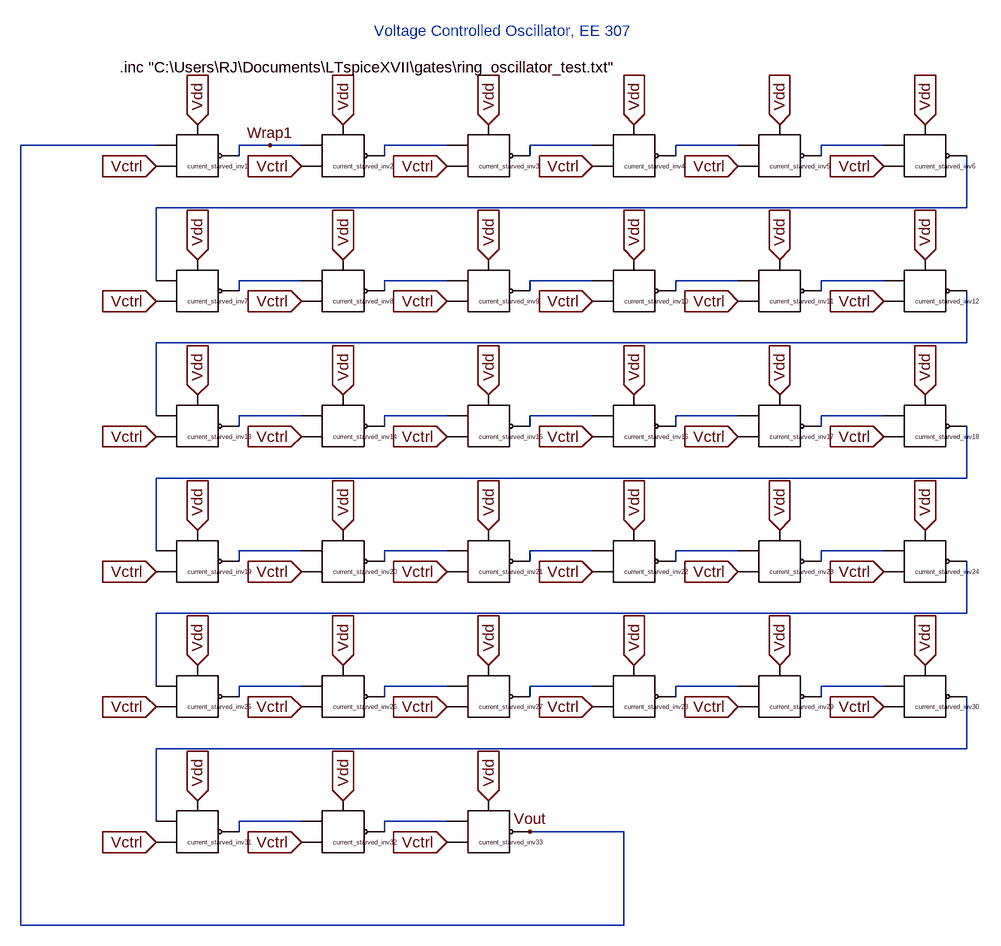
[diagram p0: schematic ring_oscillator.asc]
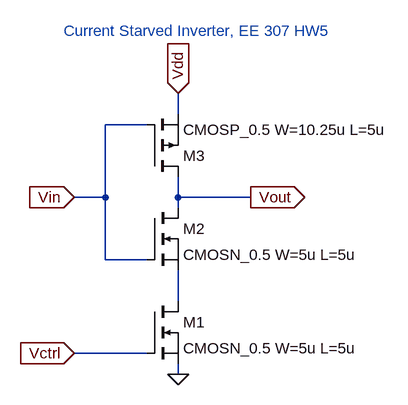
[diagram p1: sub-circuit current_starved_inverter.asc]
ring_oscillator.asc, the LTspice schematic file:
Version 4
SHEET 1 1604 1524
WIRE -256 208 -464 208
WIRE -80 208 -128 208
WIRE -32 208 -80 208
WIRE 192 208 96 208
WIRE 416 208 320 208
WIRE 640 208 544 208
WIRE 864 208 768 208
WIRE -128 224 -128 208
WIRE 96 224 96 208
WIRE 320 224 320 208
WIRE 544 224 544 208
WIRE 768 224 768 208
WIRE 992 304 992 224
WIRE 992 304 -256 304
WIRE -256 416 -256 304
WIRE -32 416 -128 416
WIRE 192 416 96 416
WIRE 416 416 320 416
WIRE 640 416 544 416
WIRE 864 416 768 416
WIRE -128 432 -128 416
WIRE 96 432 96 416
WIRE 320 432 320 416
WIRE 544 432 544 416
WIRE 768 432 768 416
WIRE 992 512 992 432
WIRE 992 512 -256 512
WIRE -256 624 -256 512
WIRE -32 624 -128 624
WIRE 192 624 96 624
WIRE 416 624 320 624
WIRE 640 624 544 624
WIRE 864 624 768 624
WIRE -128 640 -128 624
WIRE 96 640 96 624
WIRE 320 640 320 624
WIRE 544 640 544 624
WIRE 768 640 768 624
WIRE 992 720 992 640
WIRE 992 720 -256 720
WIRE -256 832 -256 720
WIRE -32 832 -128 832
WIRE 192 832 96 832
WIRE 416 832 320 832
WIRE 640 832 544 832
WIRE 864 832 768 832
WIRE -128 848 -128 832
WIRE 96 848 96 832
WIRE 320 848 320 832
WIRE 544 848 544 832
WIRE 768 848 768 832
WIRE 992 928 992 848
WIRE 992 928 -256 928
WIRE -256 1040 -256 928
WIRE -32 1040 -128 1040
WIRE 192 1040 96 1040
WIRE 416 1040 320 1040
WIRE 640 1040 544 1040
WIRE 864 1040 768 1040
WIRE -128 1056 -128 1040
WIRE 96 1056 96 1040
WIRE 320 1056 320 1040
WIRE 544 1056 544 1040
WIRE 768 1056 768 1040
WIRE 992 1136 992 1056
WIRE 992 1136 -256 1136
WIRE -256 1248 -256 1136
WIRE -32 1248 -128 1248
WIRE 192 1248 96 1248
WIRE -128 1264 -128 1248
WIRE 96 1264 96 1248
WIRE 464 1264 320 1264
WIRE -464 1408 -464 208
WIRE 464 1408 464 1264
WIRE 464 1408 -464 1408
FLAG -192 176 Vdd
IOPIN -192 176 In
FLAG 32 176 Vdd
IOPIN 32 176 In
FLAG -256 240 Vctrl
IOPIN -256 240 In
FLAG -32 240 Vctrl
IOPIN -32 240 In
FLAG 256 176 Vdd
IOPIN 256 176 In
FLAG 480 176 Vdd
IOPIN 480 176 In
FLAG 192 240 Vctrl
IOPIN 192 240 In
FLAG 416 240 Vctrl
IOPIN 416 240 In
FLAG 704 176 Vdd
IOPIN 704 176 In
FLAG 928 176 Vdd
IOPIN 928 176 In
FLAG 640 240 Vctrl
IOPIN 640 240 In
FLAG 864 240 Vctrl
IOPIN 864 240 In
FLAG -192 384 Vdd
IOPIN -192 384 In
FLAG 32 384 Vdd
IOPIN 32 384 In
FLAG -256 448 Vctrl
IOPIN -256 448 In
FLAG -32 448 Vctrl
IOPIN -32 448 In
FLAG 256 384 Vdd
IOPIN 256 384 In
FLAG 480 384 Vdd
IOPIN 480 384 In
FLAG 192 448 Vctrl
IOPIN 192 448 In
FLAG 416 448 Vctrl
IOPIN 416 448 In
FLAG 704 384 Vdd
IOPIN 704 384 In
FLAG 928 384 Vdd
IOPIN 928 384 In
FLAG 640 448 Vctrl
IOPIN 640 448 In
FLAG 864 448 Vctrl
IOPIN 864 448 In
FLAG -192 592 Vdd
IOPIN -192 592 In
FLAG 32 592 Vdd
IOPIN 32 592 In
FLAG -256 656 Vctrl
IOPIN -256 656 In
FLAG -32 656 Vctrl
IOPIN -32 656 In
FLAG 256 592 Vdd
IOPIN 256 592 In
FLAG 480 592 Vdd
IOPIN 480 592 In
FLAG 192 656 Vctrl
IOPIN 192 656 In
FLAG 416 656 Vctrl
IOPIN 416 656 In
FLAG 704 592 Vdd
IOPIN 704 592 In
FLAG 928 592 Vdd
IOPIN 928 592 In
FLAG 640 656 Vctrl
IOPIN 640 656 In
FLAG 864 656 Vctrl
IOPIN 864 656 In
FLAG -192 800 Vdd
IOPIN -192 800 In
FLAG 32 800 Vdd
IOPIN 32 800 In
FLAG -256 864 Vctrl
IOPIN -256 864 In
FLAG -32 864 Vctrl
IOPIN -32 864 In
FLAG 256 800 Vdd
IOPIN 256 800 In
FLAG 480 800 Vdd
IOPIN 480 800 In
FLAG 192 864 Vctrl
IOPIN 192 864 In
FLAG 416 864 Vctrl
IOPIN 416 864 In
FLAG 704 800 Vdd
IOPIN 704 800 In
FLAG 928 800 Vdd
IOPIN 928 800 In
FLAG 640 864 Vctrl
IOPIN 640 864 In
FLAG 864 864 Vctrl
IOPIN 864 864 In
FLAG -192 1008 Vdd
IOPIN -192 1008 In
FLAG 32 1008 Vdd
IOPIN 32 1008 In
FLAG -256 1072 Vctrl
IOPIN -256 1072 In
FLAG -32 1072 Vctrl
IOPIN -32 1072 In
FLAG 256 1008 Vdd
IOPIN 256 1008 In
FLAG 480 1008 Vdd
IOPIN 480 1008 In
FLAG 192 1072 Vctrl
IOPIN 192 1072 In
FLAG 416 1072 Vctrl
IOPIN 416 1072 In
FLAG 704 1008 Vdd
IOPIN 704 1008 In
FLAG 928 1008 Vdd
IOPIN 928 1008 In
FLAG 640 1072 Vctrl
IOPIN 640 1072 In
FLAG 864 1072 Vctrl
IOPIN 864 1072 In
FLAG -192 1216 Vdd
IOPIN -192 1216 In
FLAG -256 1280 Vctrl
IOPIN -256 1280 In
FLAG 32 1216 Vdd
IOPIN 32 1216 In
FLAG 256 1216 Vdd
IOPIN 256 1216 In
FLAG -32 1280 Vctrl
IOPIN -32 1280 In
FLAG 192 1280 Vctrl
IOPIN 192 1280 In
FLAG 320 1264 Vout
FLAG -80 208 Wrap1
SYMBOL current_starved_inverter -192 224 R0
SYMATTR InstName current_starved_inv1
SYMBOL current_starved_inverter 32 224 R0
SYMATTR InstName current_starved_inv2
SYMBOL current_starved_inverter 256 224 R0
SYMATTR InstName current_starved_inv3
SYMBOL current_starved_inverter 480 224 R0
SYMATTR InstName current_starved_inv4
SYMBOL current_starved_inverter 704 224 R0
SYMATTR InstName current_starved_inv5
SYMBOL current_starved_inverter 928 224 R0
SYMATTR InstName current_starved_inv6
SYMBOL current_starved_inverter -192 432 R0
SYMATTR InstName current_starved_inv7
SYMBOL current_starved_inverter 32 432 R0
SYMATTR InstName current_starved_inv8
SYMBOL current_starved_inverter 256 432 R0
SYMATTR InstName current_starved_inv9
SYMBOL current_starved_inverter 480 432 R0
SYMATTR InstName current_starved_inv10
SYMBOL current_starved_inverter 704 432 R0
SYMATTR InstName current_starved_inv11
SYMBOL current_starved_inverter 928 432 R0
SYMATTR InstName current_starved_inv12
SYMBOL current_starved_inverter -192 640 R0
SYMATTR InstName current_starved_inv13
SYMBOL current_starved_inverter 32 640 R0
SYMATTR InstName current_starved_inv14
SYMBOL current_starved_inverter 256 640 R0
SYMATTR InstName current_starved_inv15
SYMBOL current_starved_inverter 480 640 R0
SYMATTR InstName current_starved_inv16
SYMBOL current_starved_inverter 704 640 R0
SYMATTR InstName current_starved_inv17
SYMBOL current_starved_inverter 928 640 R0
SYMATTR InstName current_starved_inv18
SYMBOL current_starved_inverter -192 848 R0
SYMATTR InstName current_starved_inv19
SYMBOL current_starved_inverter 32 848 R0
SYMATTR InstName current_starved_inv20
SYMBOL current_starved_inverter 256 848 R0
SYMATTR InstName current_starved_inv21
SYMBOL current_starved_inverter 480 848 R0
SYMATTR InstName current_starved_inv22
SYMBOL current_starved_inverter 704 848 R0
SYMATTR InstName current_starved_inv23
SYMBOL current_starved_inverter 928 848 R0
SYMATTR InstName current_starved_inv24
SYMBOL current_starved_inverter -192 1056 R0
SYMATTR InstName current_starved_inv25
SYMBOL current_starved_inverter 32 1056 R0
SYMATTR InstName current_starved_inv26
SYMBOL current_starved_inverter 256 1056 R0
SYMATTR InstName current_starved_inv27
SYMBOL current_starved_inverter 480 1056 R0
SYMATTR InstName current_starved_inv28
SYMBOL current_starved_inverter 704 1056 R0
SYMATTR InstName current_starved_inv29
SYMBOL current_starved_inverter 928 1056 R0
SYMATTR InstName current_starved_inv30
SYMBOL current_starved_inverter -192 1264 R0
SYMATTR InstName current_starved_inv31
SYMBOL current_starved_inverter 32 1264 R0
SYMATTR InstName current_starved_inv32
SYMBOL current_starved_inverter 256 1264 R0
SYMATTR InstName current_starved_inv33
TEXT 80 32 Left 2 ;Voltage Controlled Oscillator, EE 307
TEXT -312 88 Left 2 !.inc "C:\\Users\\RJ\\Documents\\LTspiceXVII\\gates\\ring_oscillator_test.txt"

current_starved_inverter.asc, the sub-circuit schematic file:
Version 4
SHEET 1 880 680
WIRE 272 -48 272 -80
WIRE 224 -32 160 -32
WIRE 160 80 160 -32
WIRE 160 80 112 80
WIRE 272 80 272 48
WIRE 384 80 272 80
WIRE 272 96 272 80
WIRE 160 176 160 80
WIRE 224 176 160 176
WIRE 272 240 272 192
WIRE 224 320 112 320
WIRE 272 352 272 336
FLAG 272 -80 Vdd
IOPIN 272 -80 In
FLAG 112 80 Vin
IOPIN 112 80 In
FLAG 112 320 Vctrl
IOPIN 112 320 In
FLAG 272 352 0
FLAG 384 80 Vout
IOPIN 384 80 Out
SYMBOL nmos 224 240 R0
SYMATTR InstName M1
SYMATTR Value CMOSN_0.5 W=5u L=5u
SYMBOL nmos 224 96 R0
SYMATTR InstName M2
SYMATTR Value CMOSN_0.5 W=5u L=5u
SYMBOL pmos 224 48 M180
SYMATTR InstName M3
SYMATTR Value CMOSP_0.5 W=10.25u L=5u
TEXT 96 -176 Left 2 ;Current Starved Inverter, EE 307 HW5

The netlist it stands for:
* ring_oscillator.asc
Xcurrent_starved_inv1 Vout Vctrl Wrap1 Vdd current_starved_inverter
Xcurrent_starved_inv2 Wrap1 Vctrl N001 Vdd current_starved_inverter
Xcurrent_starved_inv3 N001 Vctrl N002 Vdd current_starved_inverter
Xcurrent_starved_inv4 N002 Vctrl N003 Vdd current_starved_inverter
Xcurrent_starved_inv5 N003 Vctrl N004 Vdd current_starved_inverter
Xcurrent_starved_inv6 N004 Vctrl N005 Vdd current_starved_inverter
Xcurrent_starved_inv7 N005 Vctrl N006 Vdd current_starved_inverter
Xcurrent_starved_inv8 N006 Vctrl N007 Vdd current_starved_inverter
Xcurrent_starved_inv9 N007 Vctrl N008 Vdd current_starved_inverter
Xcurrent_starved_inv10 N008 Vctrl N009 Vdd current_starved_inverter
Xcurrent_starved_inv11 N009 Vctrl N010 Vdd current_starved_inverter
Xcurrent_starved_inv12 N010 Vctrl N011 Vdd current_starved_inverter
Xcurrent_starved_inv13 N011 Vctrl N012 Vdd current_starved_inverter
Xcurrent_starved_inv14 N012 Vctrl N013 Vdd current_starved_inverter
Xcurrent_starved_inv15 N013 Vctrl N014 Vdd current_starved_inverter
Xcurrent_starved_inv16 N014 Vctrl N015 Vdd current_starved_inverter
Xcurrent_starved_inv17 N015 Vctrl N016 Vdd current_starved_inverter
Xcurrent_starved_inv18 N016 Vctrl N017 Vdd current_starved_inverter
Xcurrent_starved_inv19 N017 Vctrl N018 Vdd current_starved_inverter
Xcurrent_starved_inv20 N018 Vctrl N019 Vdd current_starved_inverter
Xcurrent_starved_inv21 N019 Vctrl N020 Vdd current_starved_inverter
Xcurrent_starved_inv22 N020 Vctrl N021 Vdd current_starved_inverter
Xcurrent_starved_inv23 N021 Vctrl N022 Vdd current_starved_inverter
Xcurrent_starved_inv24 N022 Vctrl N023 Vdd current_starved_inverter
Xcurrent_starved_inv25 N023 Vctrl N024 Vdd current_starved_inverter
Xcurrent_starved_inv26 N024 Vctrl N025 Vdd current_starved_inverter
Xcurrent_starved_inv27 N025 Vctrl N026 Vdd current_starved_inverter
Xcurrent_starved_inv28 N026 Vctrl N027 Vdd current_starved_inverter
Xcurrent_starved_inv29 N027 Vctrl N028 Vdd current_starved_inverter
Xcurrent_starved_inv30 N028 Vctrl N029 Vdd current_starved_inverter
Xcurrent_starved_inv31 N029 Vctrl N030 Vdd current_starved_inverter
Xcurrent_starved_inv32 N030 Vctrl N031 Vdd current_starved_inverter
Xcurrent_starved_inv33 N031 Vctrl Vout Vdd current_starved_inverter

* block symbol definitions
.subckt current_starved_inverter Vin Vctrl Vout Vdd
M1 N001 Vctrl 0 0 CMOSN_0.5 W=5u L=5u
M2 Vout Vin N001 N001 CMOSN_0.5 W=5u L=5u
M3 Vout Vin Vdd Vdd CMOSP_0.5 W=10.25u L=5u
* Current Starved Inverter, EE 307 HW5
.ends current_starved_inverter

.model NMOS NMOS
.model PMOS PMOS
.lib standard.mos
* Voltage Controlled Oscillator, EE 307
.inc "C:\Users\RJ\Documents\LTspiceXVII\gates\ring_oscillator_test.txt"
.backanno
.end